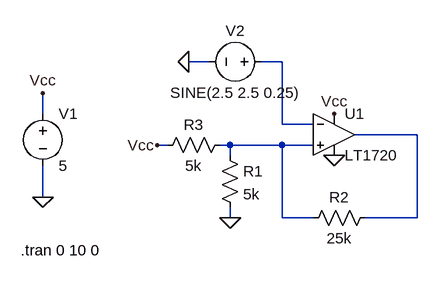
[diagram p0: schematic Hysterisis Sim.asc]
Hysterisis Sim.asc, the LTspice schematic file:
Version 4
SHEET 1 880 680
WIRE -32 16 -64 16
WIRE 80 16 48 16
WIRE -288 96 -288 64
WIRE 80 112 80 16
WIRE 128 112 80 112
WIRE 288 128 192 128
WIRE -96 144 -112 144
WIRE 0 144 -16 144
WIRE 80 144 0 144
WIRE 128 144 80 144
WIRE 0 160 0 144
WIRE -288 224 -288 176
WIRE 0 256 0 240
WIRE 80 256 80 144
WIRE 128 256 80 256
WIRE 288 256 288 128
WIRE 288 256 208 256
FLAG 160 160 0
FLAG 0 256 0
FLAG 160 96 Vcc
FLAG -112 144 Vcc
FLAG -288 64 Vcc
FLAG -288 224 0
FLAG -64 16 0
SYMBOL Comparators\\LT1720 160 64 R0
SYMATTR InstName U1
SYMBOL res -16 144 R0
SYMATTR InstName R1
SYMATTR Value 5k
SYMBOL res 224 240 R90
WINDOW 0 0 56 VBottom 2
WINDOW 3 32 56 VTop 2
SYMATTR InstName R2
SYMATTR Value 25k
SYMBOL res 0 128 R90
WINDOW 0 0 56 VBottom 2
WINDOW 3 32 56 VTop 2
SYMATTR InstName R3
SYMATTR Value 5k
SYMBOL voltage -288 80 R0
WINDOW 123 0 0 Left 0
WINDOW 39 0 0 Left 0
SYMATTR InstName V1
SYMATTR Value 5
SYMBOL voltage 64 16 R90
WINDOW 0 -32 56 VBottom 2
WINDOW 3 32 56 VTop 2
WINDOW 123 0 0 Left 0
WINDOW 39 0 0 Left 0
SYMATTR InstName V2
SYMATTR Value SINE(2.5 2.5 0.25)
TEXT -322 306 Left 2 !.tran 0 10 0

The netlist it stands for:
* Hysterisis Sim.asc
XU1 N003 N001 Vcc 0 N002 LT1720  ; pins In+ In- V+ V- OUT
R1 N003 0 5k
R2 N002 N003 25k
R3 N003 Vcc 5k
V1 Vcc 0 5
V2 N001 0 SINE(2.5 2.5 0.25)
.tran 0 10 0
.lib LT1720.sub
.backanno
.end